# Altium schematic sheet GSB-S05-V00-PSU3V3.SchDoc
size A4
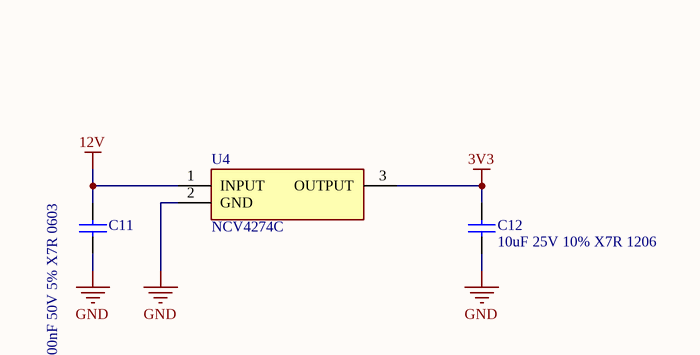
[diagram p0: GSB-S05-V00-PSU3V3.SchDoc]

## Parts
C11  100nF 50V 5% X7R 0603  [Cap_Ceramic_0603]
C12  10uF 25V 10% X7R 1206  [Cap_Ceramic_1206]
U4  NCV4274C  [NCV4274CDT50RKG]

## Nets
3V3: C12.2 U4.3(OUTPUT)
12V: C11.2 U4.1(INPUT)
GND: C11.1 C12.1 U4.2(GND)

## Library data of the parts
C11 = 100nF 50V 5% X7R 0603: Capacitor, Ceramic, SMD, 100nF, 50V, 5%, X7R, 0603
C12 = 10uF 25V 10% X7R 1206: Capacitor, Ceramic, SMD, 10uF, 25V, 10%, X7R, 1206
U4 = NCV4274C: Integrated Circuit; Manufacturer_Name: ON Semiconductor; Datasheet Link: https://www.onsemi.com/pub/Collateral/NCV4274C-D.PDF; Height: 2.38mm; Manufacturer_Part_Number: NCV4274CDT50RKG; Arrow Part Number: NCV4274CDT50RKG; Arrow Price/Stock: https://www.arrow.com/en/products/ncv4274cdt50rkg/on-semiconductor; Mouser Part Number: 863-NCV4274CDT50RKG; Mouser Price/Stock: https://www.mouser.co.uk/ProductDetail/ON-Semiconductor/NCV4274CDT50RKG?qs=tCMd4XlZ%2FiBk5MdmOBr7cw%3D%3D